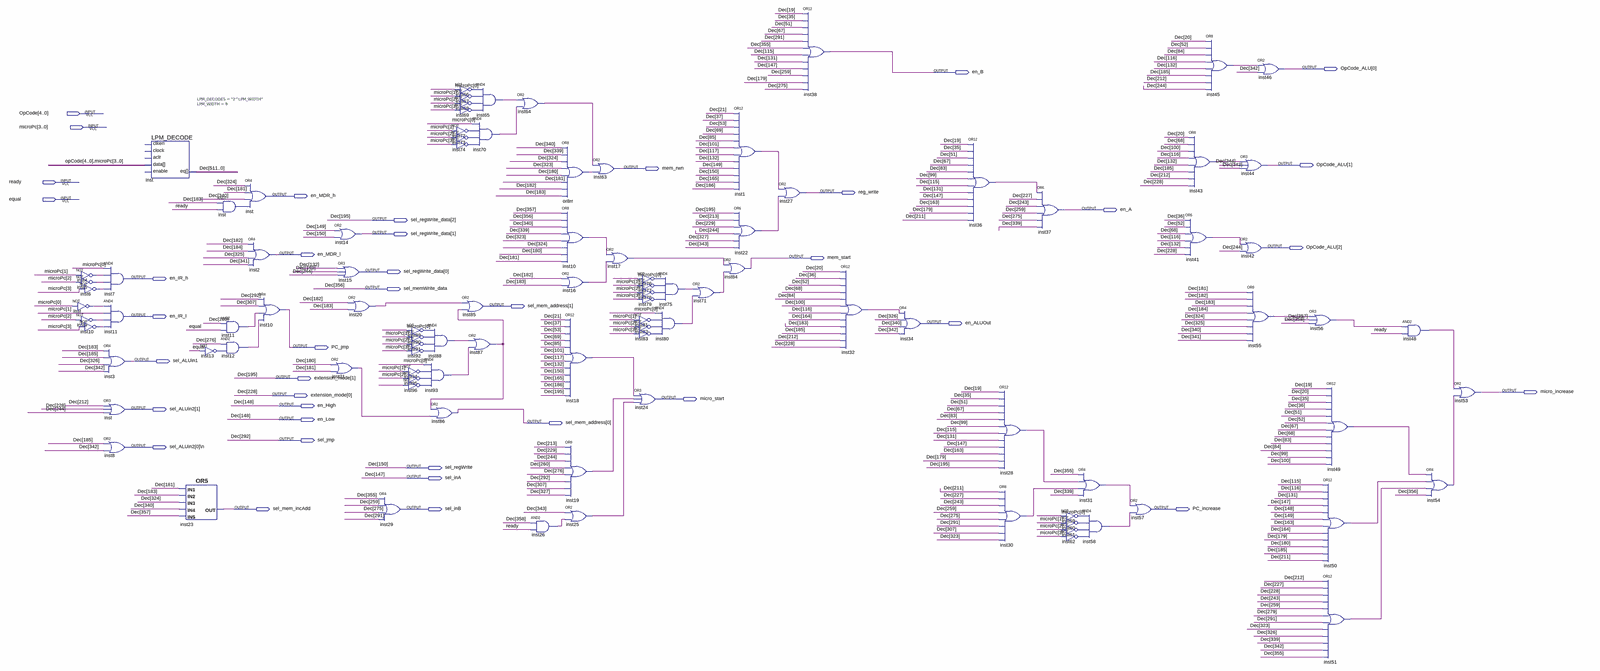
[diagram p0: schematic sheet, whole]
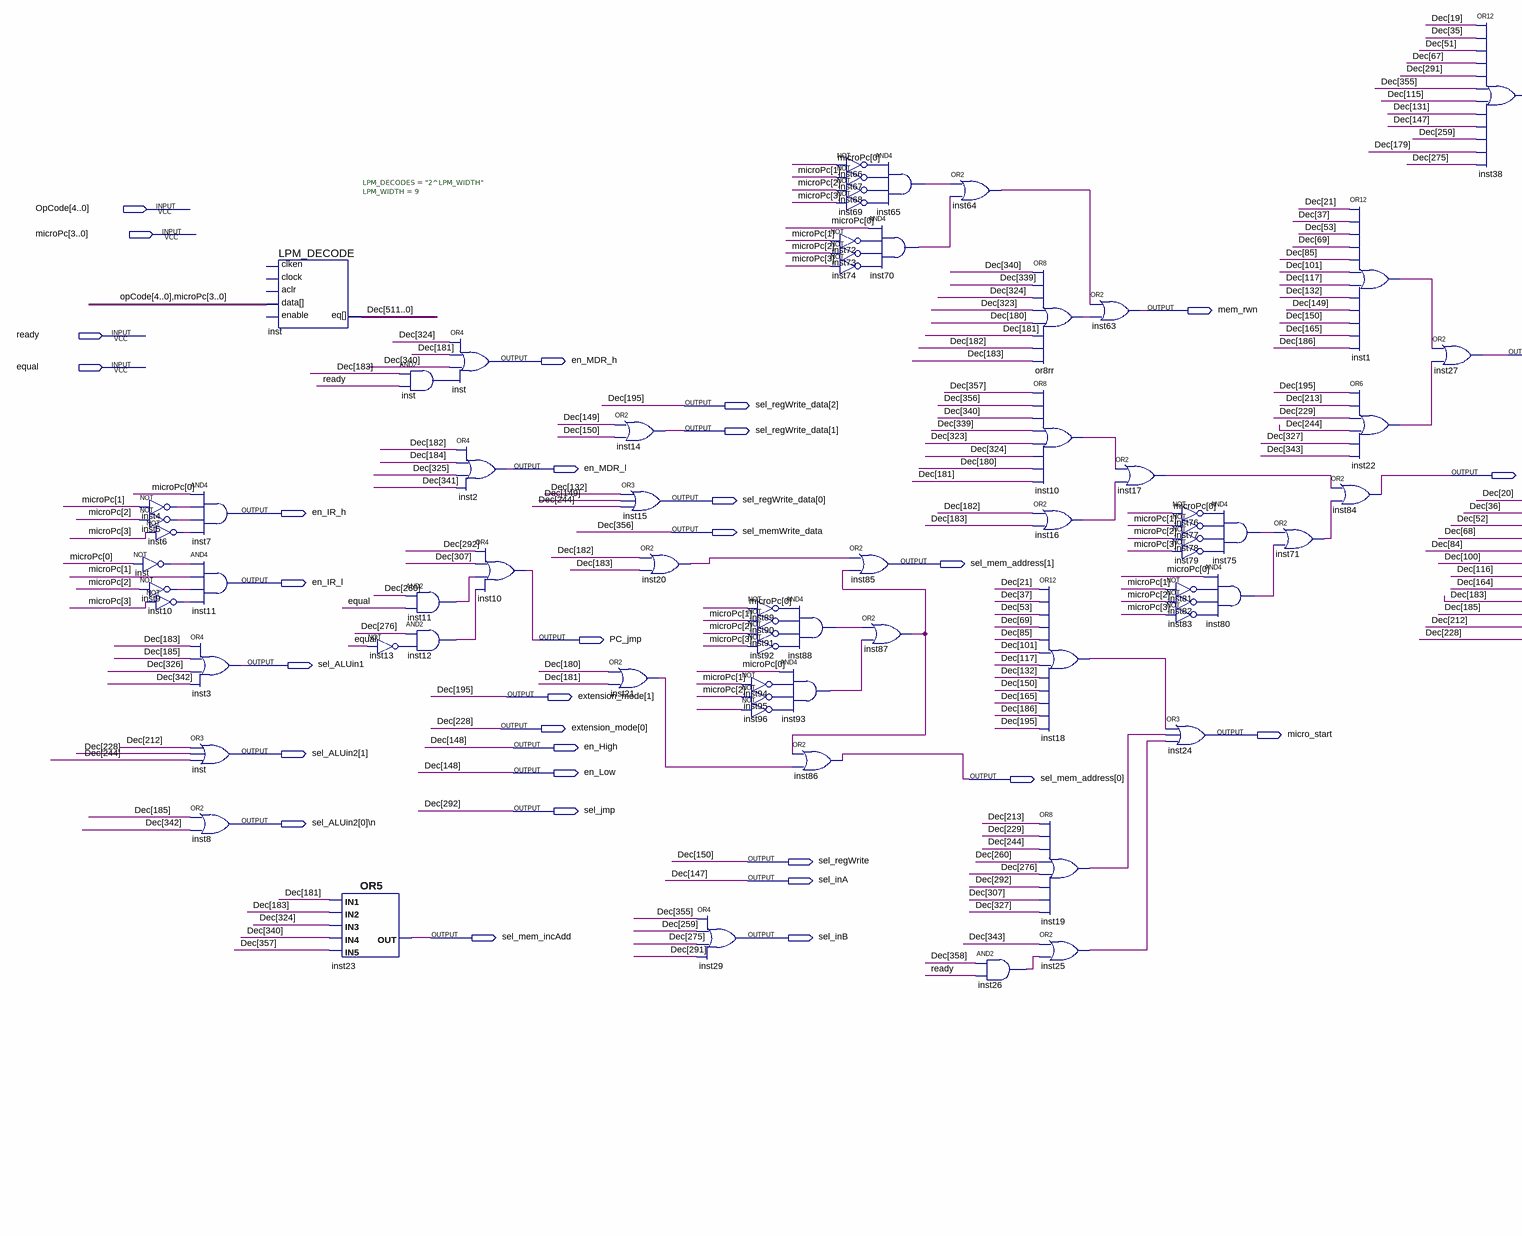
[diagram p1: schematic sheet, left part]
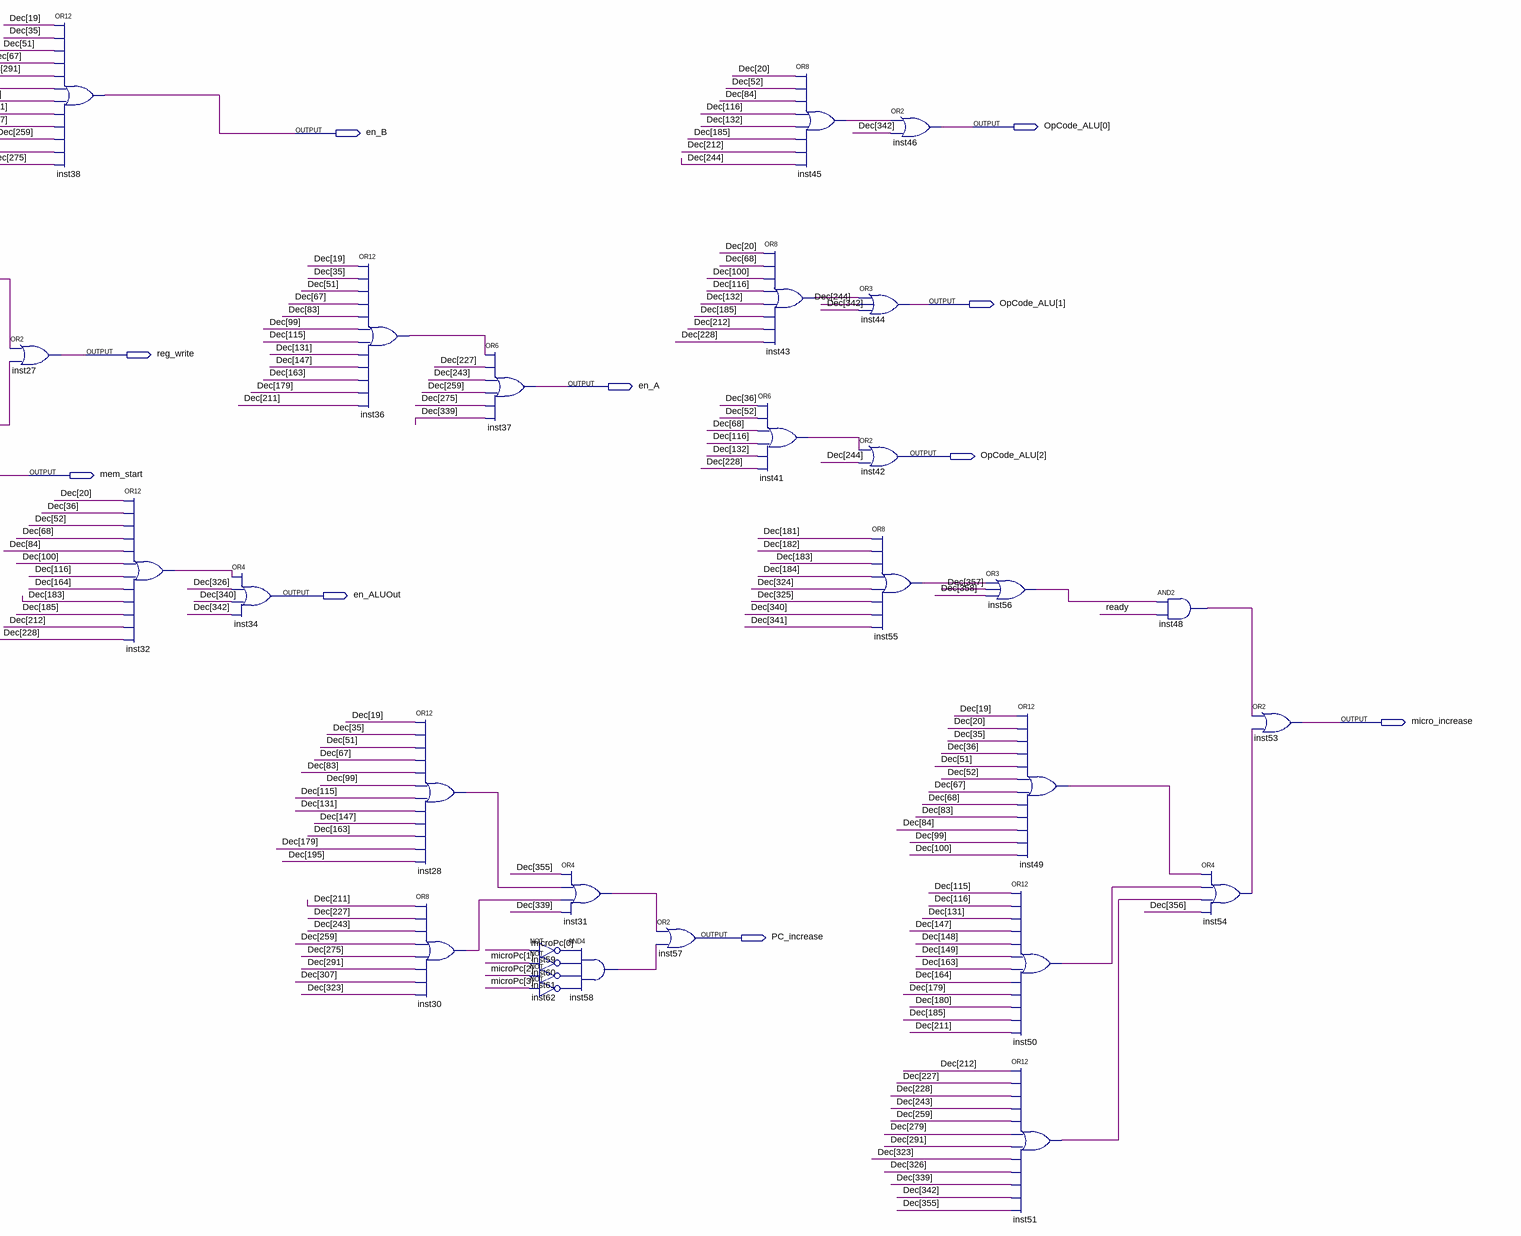
[diagram p2: schematic sheet, right part]
// Quartus schematic CU.bdf as structural Verilog: 99 symbols, 39 pins
module CU (
  input  [4:0] OpCode,
  input  [3:0] microPc,
  input  ready,
  input  equal,
  output [2:0] OpCode_ALU,
  output en_B,
  output mem_rwn,
  output reg_write,
  output en_MDR_h,
  output en_A,
  output [2:0] sel_regWrite_data,
  output en_MDR_l,
  output mem_start,
  output en_IR_h,
  output sel_memWrite_data,
  output [1:0] sel_mem_address,
  output en_IR_l,
  output en_ALUOut,
  output PC_jmp,
  output sel_ALUin1,
  output [1:0] extension_mode,
  output micro_increase,
  output micro_start,
  output en_High,
  output [1:1] sel_ALUin2,
  output en_Low,
  output sel_jmp,
  output \sel_ALUin2[0]\n ,
  output sel_regWrite,
  output sel_inA,
  output sel_mem_incAdd,
  output sel_inB,
  output PC_increase
);

  wire inst1_out, inst4_out, inst5_out, inst6_out, inst9_out, inst10_out, inst10_out_2, inst11_out,
       inst12_out, inst13_out, inst16_out, inst17_out, inst18_out, inst19_out, inst20_out, inst21_out,
       inst22_out, inst25_out, inst26_out, inst28_out, inst30_out, inst31_out, inst32_out, inst36_out,
       inst41_out, inst43_out, inst45_out, inst48_out, inst49_out, inst50_out, inst51_out, inst54_out,
       inst55_out, inst56_out, inst58_out, inst59_out, inst60_out, inst61_out, inst62_out, inst64_out,
       inst65_out, inst66_out, inst67_out, inst68_out, inst69_out, inst70_out, inst71_out, inst72_out,
       inst73_out, inst74_out, inst75_out, inst76_out, inst77_out, inst78_out, inst79_out, inst80_out,
       inst81_out, inst82_out, inst83_out, inst87_out, inst88_out, inst89_out, inst90_out, inst91_out,
       inst92_out, inst93_out, inst94_out, inst95_out, inst96_out, inst_out, inst_out_2, or8rr_out, undriven;
  wire [511:0] Dec;

  not inst4 (inst4_out, microPc[1]);
  not inst5 (inst5_out, microPc[2]);
  not inst6 (inst6_out, microPc[3]);
  not inst (inst_out, microPc[0]);
  not inst9 (inst9_out, microPc[2]);
  not inst10 (inst10_out, microPc[3]);
  and inst7 (en_IR_h, microPc[0], inst4_out, inst5_out, inst6_out);
  and inst11 (en_IR_l, inst_out, microPc[1], inst9_out, inst10_out);
  or inst3 (sel_ALUin1, Dec[183], Dec[185], Dec[326], Dec[342]);
  or inst_dup2 (sel_ALUin2[1], Dec[212], extension_mode[0], Dec[244]);
  or inst8 (\sel_ALUin2[0]\n , Dec[185], Dec[342]);
  LPM_DECODE #(.LPM_DECODES("2^LPM_WIDTH"), .LPM_WIDTH(9)) inst_dup3 (
    .data({OpCode, microPc}),
    .eq({Dec[511:357], sel_memWrite_data, Dec[355:293], sel_jmp, Dec[291:229], extension_mode[0], Dec[227:196], extension_mode[1], Dec[194:151], sel_regWrite, Dec[149], en_High, sel_inA, Dec[146:0]}));  // open: enable, clken, clock, aclr
  not inst13 (inst13_out, equal);
  or inst23 (sel_mem_incAdd, Dec[181], Dec[183], Dec[324], Dec[340], Dec[357]);
  and inst_dup4 (inst_out_2, Dec[183], ready);
  and inst11_dup2 (inst11_out, Dec[260], equal);
  and inst12 (inst12_out, Dec[276], inst13_out);
  or inst_dup5 (en_MDR_h, Dec[324], Dec[181], Dec[340], inst_out_2);
  or inst2 (en_MDR_l, Dec[182], Dec[184], Dec[325], Dec[341]);
  or inst10_dup2 (PC_jmp, sel_jmp, Dec[307], inst11_out, inst12_out);
  or inst14 (sel_regWrite_data[1], Dec[149], sel_regWrite);
  or inst15 (sel_regWrite_data[0], Dec[132], Dec[149], Dec[244]);
  or inst21 (inst21_out, Dec[180], Dec[181]);
  or inst20 (inst20_out, Dec[182], Dec[183]);
  or inst29 (sel_inB, Dec[355], Dec[259], Dec[275], Dec[291]);
  not inst89 (inst89_out, microPc[0]);
  not inst90 (inst90_out, microPc[1]);
  not inst91 (inst91_out, microPc[2]);
  not inst92 (inst92_out, microPc[3]);
  and inst93 (inst93_out, microPc[0], inst94_out, inst95_out, inst96_out);
  not inst94 (inst94_out, microPc[1]);
  not inst95 (inst95_out, microPc[2]);
  not inst96 (inst96_out, undriven);
  not inst72 (inst72_out, microPc[1]);
  not inst73 (inst73_out, microPc[2]);
  not inst74 (inst74_out, microPc[3]);
  and inst88 (inst88_out, inst89_out, inst90_out, inst91_out, inst92_out);
  or inst86 (sel_mem_address[0], inst87_out, inst21_out);
  and inst65 (inst65_out, inst66_out, inst67_out, inst68_out, inst69_out);
  not inst66 (inst66_out, microPc[0]);
  not inst67 (inst67_out, microPc[1]);
  not inst68 (inst68_out, microPc[2]);
  not inst69 (inst69_out, microPc[3]);
  and inst70 (inst70_out, microPc[0], inst72_out, inst73_out, inst74_out);
  or inst85 (sel_mem_address[1], inst20_out, inst87_out);
  or inst87 (inst87_out, inst88_out, inst93_out);
  or inst64 (inst64_out, inst65_out, inst70_out);
  and inst26 (inst26_out, Dec[358], ready);
  or or8rr (or8rr_out, Dec[340], Dec[339], Dec[324], Dec[323], Dec[180], Dec[181], Dec[182], Dec[183]);
  or inst10_dup3 (inst10_out_2, Dec[357], sel_memWrite_data, Dec[340], Dec[339], Dec[323], Dec[324], Dec[180], Dec[181]);
  or inst16 (inst16_out, Dec[182], Dec[183]);
  or inst18 (inst18_out, Dec[21], Dec[37], Dec[53], Dec[69], Dec[85], Dec[101], Dec[117], Dec[132], sel_regWrite, Dec[165], Dec[186], extension_mode[1]);
  or inst19 (inst19_out, Dec[213], Dec[229], Dec[244], Dec[260], Dec[276], sel_jmp, Dec[307], Dec[327]);
  or inst25 (inst25_out, Dec[343], inst26_out);
  or inst63 (mem_rwn, inst64_out, or8rr_out);
  or inst17 (inst17_out, inst10_out_2, inst16_out);
  not inst76 (inst76_out, microPc[0]);
  not inst77 (inst77_out, microPc[1]);
  not inst78 (inst78_out, microPc[2]);
  not inst79 (inst79_out, microPc[3]);
  not inst81 (inst81_out, microPc[1]);
  not inst82 (inst82_out, microPc[2]);
  not inst83 (inst83_out, microPc[3]);
  or inst24 (micro_start, inst18_out, inst19_out, inst25_out);
  and inst75 (inst75_out, inst76_out, inst77_out, inst78_out, inst79_out);
  and inst80 (inst80_out, microPc[0], inst81_out, inst82_out, inst83_out);
  or inst71 (inst71_out, inst75_out, inst80_out);
  or inst84 (mem_start, inst17_out, inst71_out);
  or inst1 (inst1_out, Dec[21], Dec[37], Dec[53], Dec[69], Dec[85], Dec[101], Dec[117], Dec[132], Dec[149], sel_regWrite, Dec[165], Dec[186]);
  or inst22 (inst22_out, extension_mode[1], Dec[213], Dec[229], Dec[244], Dec[327], Dec[343]);
  or inst27 (reg_write, inst1_out, inst22_out);
  or inst38 (en_B, Dec[19], Dec[35], Dec[51], Dec[67], Dec[291], Dec[355], Dec[115], Dec[131], sel_inA, Dec[259], Dec[179], Dec[275]);
  or inst32 (inst32_out, Dec[20], Dec[36], Dec[52], Dec[68], Dec[84], Dec[100], Dec[116], Dec[164], Dec[183], Dec[185], Dec[212], extension_mode[0]);
  or inst34 (en_ALUOut, inst32_out, Dec[326], Dec[340], Dec[342]);
  or inst36 (inst36_out, Dec[19], Dec[35], Dec[51], Dec[67], Dec[83], Dec[99], Dec[115], Dec[131], sel_inA, Dec[163], Dec[179], Dec[211]);
  or inst28 (inst28_out, Dec[19], Dec[35], Dec[51], Dec[67], Dec[83], Dec[99], Dec[115], Dec[131], sel_inA, Dec[163], Dec[179], extension_mode[1]);
  or inst30 (inst30_out, Dec[211], Dec[227], Dec[243], Dec[259], Dec[275], Dec[291], Dec[307], Dec[323]);
  or inst37 (en_A, inst36_out, Dec[227], Dec[243], Dec[259], Dec[275], Dec[339]);
  or inst31 (inst31_out, Dec[355], inst28_out, inst30_out, Dec[339]);
  and inst58 (inst58_out, inst59_out, inst60_out, inst61_out, inst62_out);
  not inst59 (inst59_out, microPc[0]);
  not inst60 (inst60_out, microPc[1]);
  not inst61 (inst61_out, microPc[2]);
  not inst62 (inst62_out, microPc[3]);
  // OR2 inst57 has open pins: IN1=inst31_out, IN2=inst58_out, OUT=open
  or inst43 (inst43_out, Dec[20], Dec[68], Dec[100], Dec[116], Dec[132], Dec[185], Dec[212], extension_mode[0]);
  or inst41 (inst41_out, Dec[36], Dec[52], Dec[68], Dec[116], Dec[132], extension_mode[0]);
  or inst45 (inst45_out, Dec[20], Dec[52], Dec[84], Dec[116], Dec[132], Dec[185], Dec[212], Dec[244]);
  or inst44 (OpCode_ALU[1], inst43_out, Dec[244], Dec[342]);
  or inst42 (OpCode_ALU[2], inst41_out, Dec[244]);
  or inst55 (inst55_out, Dec[181], Dec[182], Dec[183], Dec[184], Dec[324], Dec[325], Dec[340], Dec[341]);
  or inst46 (OpCode_ALU[0], inst45_out, Dec[342]);
  or inst56 (inst56_out, inst55_out, Dec[357], Dec[358]);
  or inst49 (inst49_out, Dec[19], Dec[20], Dec[35], Dec[36], Dec[51], Dec[52], Dec[67], Dec[68], Dec[83], Dec[84], Dec[99], Dec[100]);
  or inst50 (inst50_out, Dec[115], Dec[116], Dec[131], sel_inA, en_High, Dec[149], Dec[163], Dec[164], Dec[179], Dec[180], Dec[185], Dec[211]);
  or inst51 (inst51_out, Dec[212], Dec[227], extension_mode[0], Dec[243], Dec[259], Dec[279], Dec[291], Dec[323], Dec[326], Dec[339], Dec[342], Dec[355]);
  and inst48 (inst48_out, inst56_out, ready);
  or inst54 (inst54_out, inst49_out, inst50_out, inst51_out, sel_memWrite_data);
  or inst53 (micro_increase, inst48_out, inst54_out);

  assign en_Low = en_High;
  assign sel_regWrite_data[2] = extension_mode[1];

  // Other names for the same wires on the sheet: Dec (some bits) = {sel_memWrite_data, sel_jmp, extension_mode[0], extension_mode[1], sel_regWrite, en_High, sel_inA}
endmodule
